# EAGLE design eink-type1 (EAGLE 7.7.0)
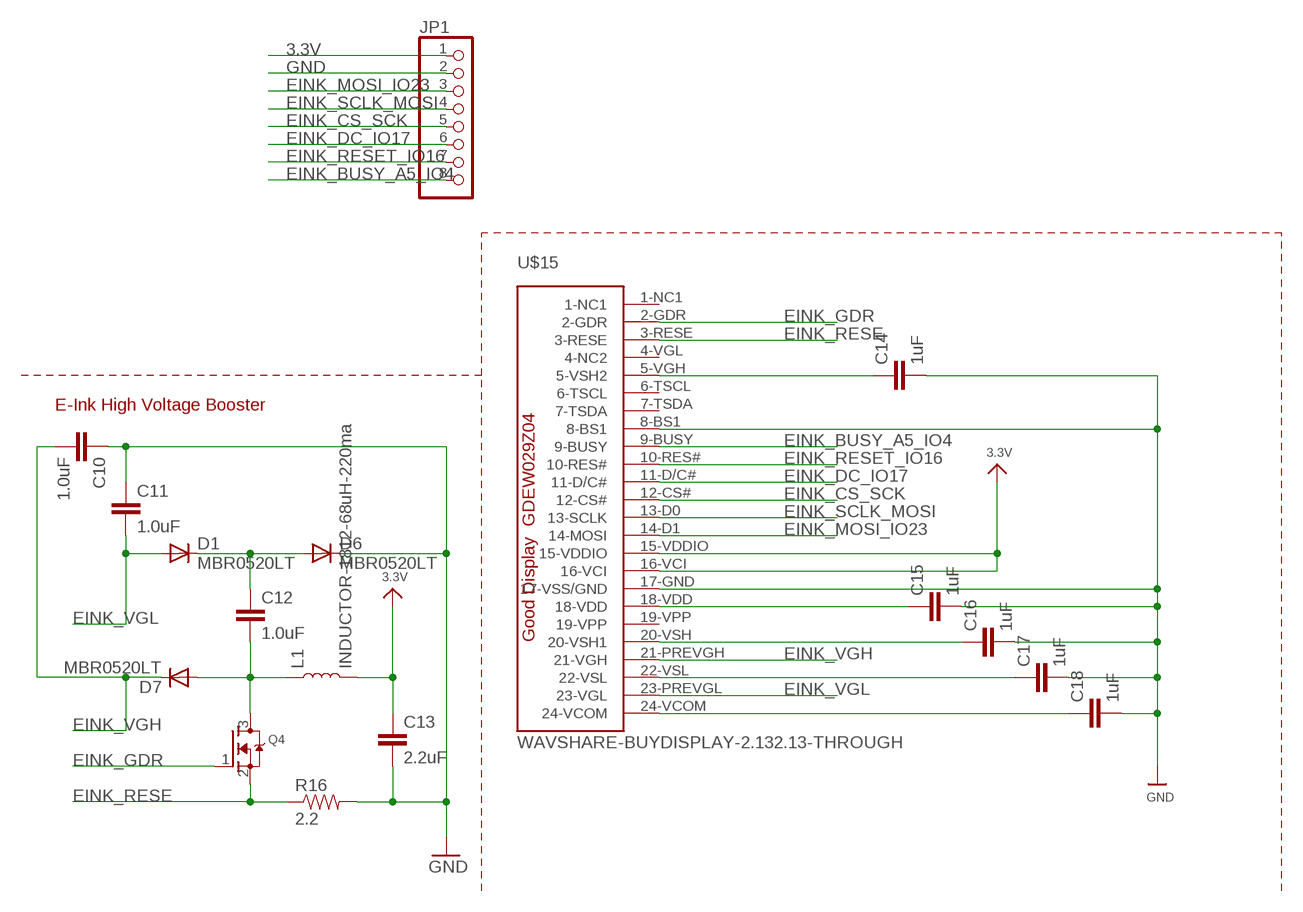
[diagram p0: schematic, sheet 1]

## Parts
C10  1.0uF  1.0UF-0603-16V-10%  [0603]
C11  1.0uF  1.0UF-0603-16V-10%  [0603]
C12  1.0uF  1.0UF-0603-16V-10%  [0603]
C13  2.2uF  2.2UF-0603-10V-20%  [0603]
C14  1uF  0.1UF-25V-5%(0603)  [0603-CAP]
C15  1uF  0.1UF-25V-5%(0603)  [0603-CAP]
C16  1uF  0.1UF-25V-5%(0603)  [0603-CAP]
C17  1uF  0.1UF-25V-5%(0603)  [0603-CAP]
C18  1uF  0.1UF-25V-5%(0603)  [0603-CAP]
D1  MBR0520LT  [SOD123]
D6  MBR0520LT  [SOD123]
D7  MBR0520LT  [SOD123]
JP1  PINHD-1X8  [1X08]
L1  INDUCTOR-1812-68uH-220ma  INDUCTOR-1812  [1812]
Q4  MOSFET-NREFLOW  [SOT23]
R16  2.2  4.7KOHM-1/10W-1%(0603)  [0603-RES]
U$15  WAVSHARE-BUYDISPLAY-2.132.13-THROUGH  [WAVSHARE-BUYDISPLAY-2.13-THM]

## Nets
3.3V: C13.1 JP1.1 L1.2 U$15.15-VDDIO U$15.16-VCI
EINK_BUSY_A5_IO4: JP1.8 U$15.9-BUSY
EINK_CS_SCK: JP1.5 U$15.12-CS#
EINK_DC_IO17: JP1.6 U$15.11-D/C#
EINK_GDR: Q4.1(G) U$15.2-GDR
EINK_MOSI_IO23: JP1.3 U$15.14-D1(14-MOSI)
EINK_RESE: Q4.2(S) R16.1 U$15.3-RESE
EINK_RESET_IO16: JP1.7 U$15.10-RES#
EINK_SCLK_MOSI: JP1.4 U$15.13-D0(13-SCLK)
EINK_VGH: C10.2 D7.C U$15.21-PREVGH(21-VGH)
EINK_VGL: C11.2 D1.A U$15.23-PREVGL(23-VGL)
GND: C10.1 C11.1 C13.2 C14.2 C15.2 C16.2 C17.2 C18.2 D6.C JP1.2 R16.2 U$15.8-BS1 U$15.17-GND(17-VSS/GND)
N$11: C12.1 D1.C D6.A
N$14: C12.2 D7.A L1.1 Q4.3(D)
N$16: C15.1 U$15.18-VDD
N$17: C16.1 U$15.20-VSH(20-VSH1)
N$18: C17.1 U$15.22-VSL
N$19: C18.1 U$15.24-VCOM
N$20: C14.1 U$15.5-VGH(5-VSH2)
Unconnected: U$15.1-NC1 U$15.4-VGL(4-NC2) U$15.6-TSCL U$15.7-TSDA U$15.19-VPP

## Notes on the sheet
- E-Ink High Voltage Booster

## Library data of the parts
C10-C12 = SparkFun-Capacitors:1.0UF: 1µF ceramic capacitors A capacitor is a passive two-terminal electrical component used to store electrical energy temporarily in an electric field.; PROD_ID: CAP-00868
C13 = SparkFun-Capacitors:2.2UF: 2.2µF ceramic capacitors A capacitor is a passive two-terminal electrical component used to store electrical energy temporarily in an electric field.; PROD_ID: CAP-07888
C14-C18 = SparkFun-Capacitors:0.1UF-25V-5%(0603): CAP-08604; PROD_ID: CAP-08604; VALUE: 0.1uF
D1 D6 D7 = diode:MBR0520LT: SCHOTTKY BARRIER RECTIFIER Source: http://onsemi.com .. MBR0520LT1-D.pdf
JP1 = pinhead:PINHD-1X8: PIN HEADER
L1 = SparkFun-Coils:INDUCTOR: Inductors Resist changes in electrical current. Basically a coil of wire. SparkFun Products: SparkFun Load Cell Amplifier - HX711 <https://www.sparkfun.com/products/13879> IOIO-OTG - V2.2 <https://www.sparkfun.com/products/13613>
Q4 = adafruit:MOSFET-N: N-Channel Mosfet 2N7002E - 60V 260mA SOT23 [Digikey: 2N7002ET1GOSTR-ND] - REEL BSH103 - 30V 850mA SOT23 [Digikey: 568-5013-1-ND]
R16 = SparkFun-Resistors:4.7KOHM-1/10W-1%(0603): RES-07857; PROD_ID: RES-07857; VALUE: 4.7K
U$15 = Warthog9-Screens:WAVSHARE-BUYDISPLAY-2.13: 2.13in EPD based on Wavshare or Buydisplay, copied from the ESP_trINKet project's setup

## Board
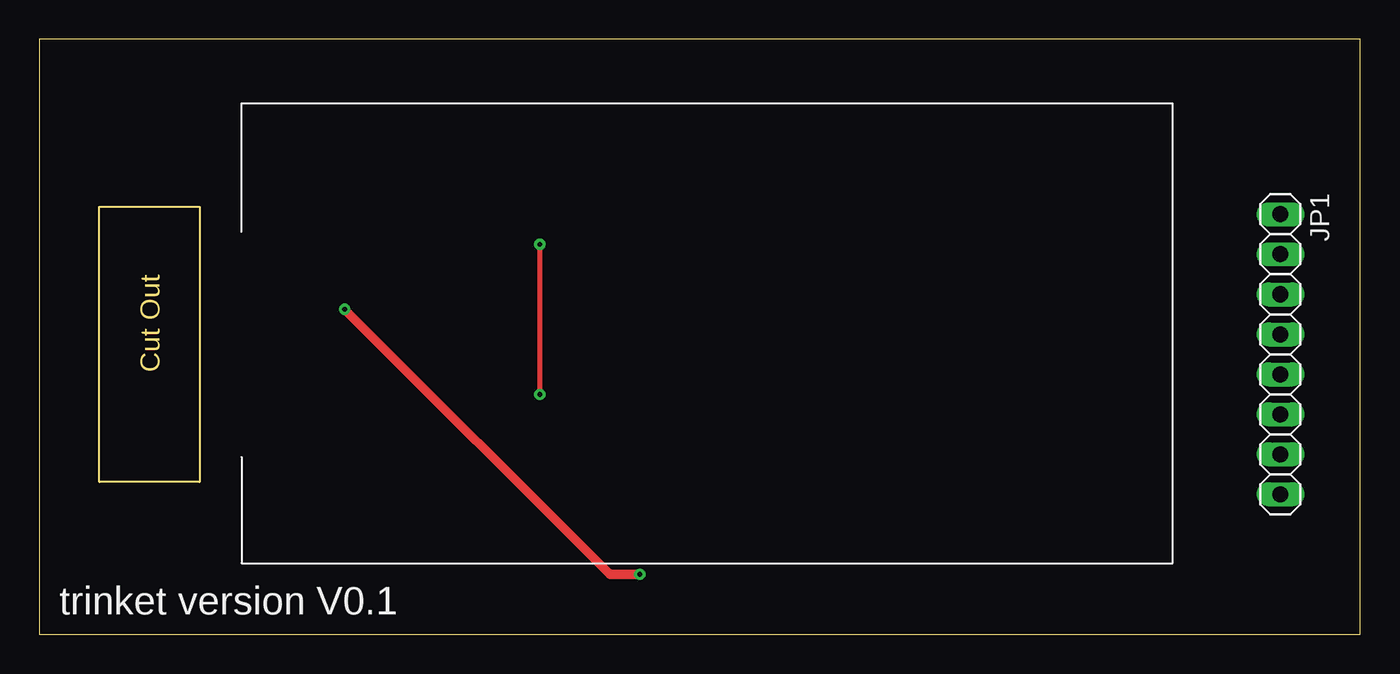
[diagram p1: board, top side]
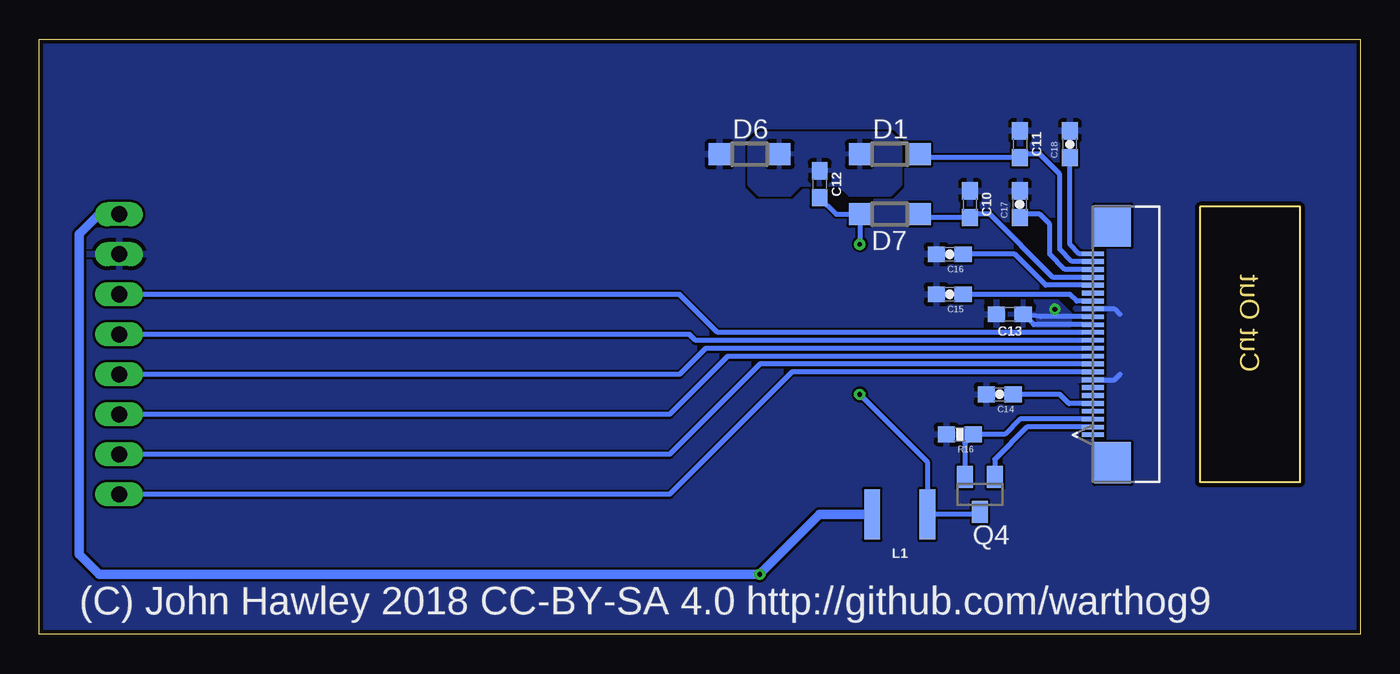
[diagram p2: board, bottom side, seen from below]

Size 83.8 x 37.77 mm. Coordinates in mm from the lower left corner, seen from the top.
Outline: 0,0 83.8,0 83.8,37.77 0,37.77 0,0
Copper layers (1*16): Top 0.035mm / dielectric 1.5mm / Bottom 0.035mm
Design rules "default *": minimum track width 6mil, minimum drill 12mil, track to track 6mil, track to pad 6mil, pad to pad 6mil, via to via 6mil, smd to smd 6mil, copper to edge 10mil, drill to drill 8mil, minimum pad ring 10mil, minimum via ring 8mil, stop-mask expansion 4mil, vias tented up to drill 0mil, thermal gap 10mil

### Footprints (pad centres in the part's own frame; a part is rotated, then mirrored left to right if it is on the bottom)
0603 = smd 1.1 x 1: 1 -0.85,0; 2 0.85,0
0603-CAP = smd 1.1 x 1: 1 -0.85,0; 2 0.85,0
SOD123 = smd 1.4 x 1.4: A 1.9,0; C -1.9,0
1X08 = drill 1.016 long: 1 -8.89,0; 2 -6.35,0; 3 -3.81,0; 4 -1.27,0; 5 1.27,0; 6 3.81,0; 7 6.35,0; 8 8.89,0
1812 = smd 1 x 3.2: 1 -1.75,0; 2 1.75,0
SOT23 = smd 1 x 1.4: 1 -0.95,-1.1; 2 0.95,-1.1; 3 0,1.1
0603-RES = smd 1.1 x 1: 1 -0.85,0; 2 0.85,0
WAVSHARE-BUYDISPLAY-2.13-THM = smd 1.397 x 0.305 bottom: 1-NC1 -4.267,12.725; 2-GDR -4.267,12.243; 3-RESE -4.267,11.735; 4-VGL -4.267,11.227; 5-VGH -4.267,10.744; 6-TSCL -4.267,10.236; 7-TSDA -4.267,9.728; 8-BS1 -4.267,9.246; 9-BUSY -4.267,8.738; 10-RES# -4.267,8.23; 11-D/C# -4.267,7.747; 12-CS# -4.267,7.239; 13-D0 -4.267,6.731; 14-D1 -4.267,6.223; 15-VDDIO -4.267,5.74; 16-VCI -4.267,5.232; 17-GND -4.267,4.724; 18-VDD -4.267,4.242; 19-VPP -4.267,3.734; 20-VSH -4.267,3.226; 21-PREVGH -4.267,2.743; 22-VSL -4.267,2.235; 23-PREVGL -4.267,1.727; 24-VCOM -4.267,1.245 | smd 2.311 x 2.642 bottom: 25 -2.997,-0.533; 26 -2.997,14.503

### Placement (x,y rotation side)
C10  24.77,27.3 270 bottom
C11  21.59,31.11 270 bottom
C12  34.29,28.57 270 bottom
C13  22.23,20.32 180 bottom
C14  22.86,15.24 180 bottom
C15  26.04,21.59 180 bottom
C16  26.04,24.13 180 bottom
C17  21.59,27.3 90 bottom
C18  18.41,31.11 90 bottom
D1  29.84,30.48 0 bottom
D6  38.73,30.48 0 bottom
D7  29.84,26.67 180 bottom
JP1  78.74,17.78 270 top
L1  29.21,7.62 180 bottom
Q4  24.13,8.89 180 bottom
R16  25.4,12.7 180 bottom
U$15  12.7,25.4 180 top

### Tracks (layer width: path | path; a pad name or v marks a point on that pad's centre or on a via)
3.3V  (via drill 0.3)
  Top 0.61: v19.37,20.64 36.2,3.81 v38.1,3.81
  Bottom 0.305: U$15.15-VDDIO 20.71,19.66 C13.1 20.26,20.17 U$15.16-VCI
  Bottom 0.61: JP1.1 80.01,26.67 81.28,25.4 81.28,5.08 80.01,3.81 v38.1,3.81 34.29,7.62 L1.2
  pour Bottom: 19.68,21.59 20.32,22.23 21.59,22.23 22.23,21.59 22.23,19.68 21.59,19.05 19.05,19.05 18.41,19.68 18.41,20.32
EINK_BUSY_A5_IO4
  Bottom 0.305: U$15.9-BUSY 36.04,16.66 43.81,8.89 JP1.8
EINK_CS_SCK
  Bottom 0.305: U$15.12-CS# 41.53,18.16 43.18,16.51 JP1.5
EINK_DC_IO17
  Bottom 0.305: U$15.11-D/C# 40.13,17.65 43.81,13.97 JP1.6
EINK_GDR
  Bottom 0.305: 23.01,10.16 Q4.1 23.18,11.11 21.13,13.16 U$15.2-GDR
EINK_MOSI_IO23
  Bottom 0.305: U$15.14-D1 40.77,19.18 43.18,21.59 JP1.3
EINK_RESE
  Bottom 0.305: Q4.2 25.08,12.17 R16.1 22.54,12.7 21.58,13.66 U$15.3-RESE
EINK_RESET_IO16
  Bottom 0.305: U$15.10-RES# 38.08,17.17 43.81,11.43 JP1.7
EINK_SCLK_MOSI
  Bottom 0.305: U$15.13-D0 42.16,18.67 42.55,19.05 JP1.4
EINK_VGH
  Bottom 0.305: D7.C 27.73,26.45 C10.2 24.55,26.67 23.5,26.67 19.48,22.66 U$15.21-PREVGH
EINK_VGL
  Bottom 0.305: U$15.23-PREVGL 18.27,23.67 19.05,24.45 19.05,29.21 20.32,30.48 21.38,30.48 C11.2 27.73,30.27 D1.A
GND
  Bottom 0.305: U$15.17-GND 15.6,20.68 15.24,20.32 | U$15.8-BS1 15.6,16.15 15.24,16.51
  pour Bottom (rank 6): -1.27,-2.54 86.36,-2.54 86.36,38.1 -1.27,38.1
N$11
  pour Bottom: 29.84,31.75 38.1,31.75 38.73,31.11 38.73,28.57 38.1,27.94 36.2,27.94 35.56,28.57 33.02,28.57 32.38,27.94 29.84,27.94 29.21,28.57 29.21,31.11
N$14  (via drill 0.3)
  Top 0.305: v31.75,24.77 v31.75,15.24
  Bottom 0.305: Q4.3 24.3,7.62 L1.1 27.46,10.95 v31.75,15.24 | C12.2 33.23,26.67 D7.A v31.75,24.77
N$16
  Bottom 0.305: C15.1 18.41,21.59 17.98,21.16 U$15.18-VDD
N$17
  Bottom 0.305: U$15.20-VSH 19.95,22.17 21.91,24.13 C16.1
N$18
  Bottom 0.305: U$15.22-VSL 18.72,23.16 19.68,24.13 19.68,26.04 20.32,26.67 21.38,26.67 C17.1
N$19
  Bottom 0.305: U$15.24-VCOM 17.8,24.16 18.41,24.77 C18.1
N$20
  Bottom 0.305: U$15.5-VGH 18.47,14.66 19.05,15.24 C14.1

### Text on the board
tPlace: trinket version V0.1
bPlace: (C) John Hawley 2018 CC-BY-SA 4.0 http://github.com/warthog9